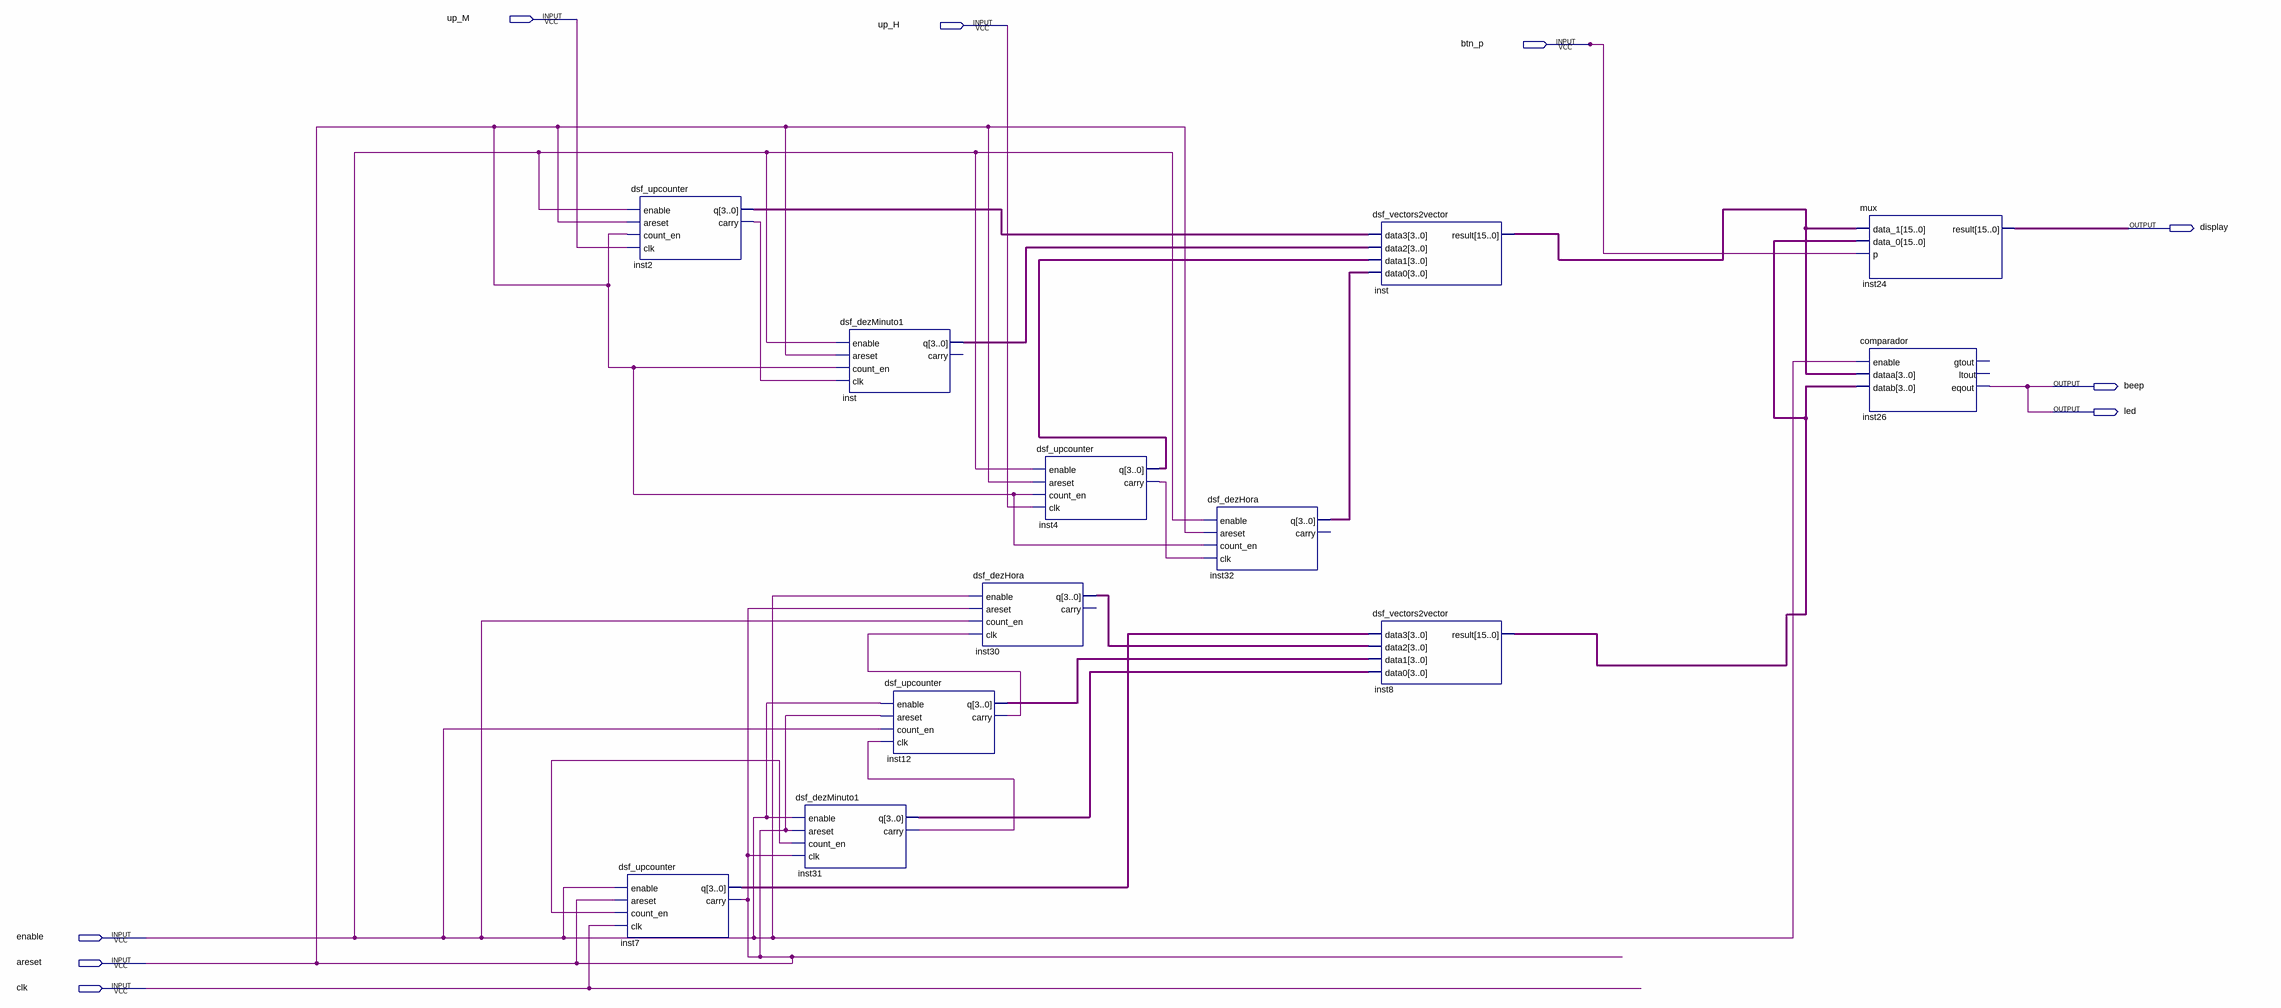
[diagram p0: schematic sheet]
// Quartus schematic Despertador.bdf as structural Verilog: 12 symbols, 9 pins
module Despertador (
  input  up_M,
  input  up_H,
  input  btn_p,
  input  enable,
  input  areset,
  input  clk,
  output display,
  output beep,
  output led
);

  wire inst2_carry, inst4_carry, inst12_carry, inst31_carry, undriven;
  wire [3:0] inst2_q, inst4_q, inst7_q, inst12_q, inst30_q, inst31_q, inst32_q, inst_q;
  wire [15:0] inst8_result, inst24_result, inst_result;

  dsf_upcounter inst7 (.enable(enable), .areset(areset), .count_en(undriven), .clk(clk), .q(inst7_q), .carry(areset));
  dsf_upcounter inst2 (
    .enable(enable), .areset(areset), .count_en(areset), .clk(up_M), .q(inst2_q), .carry(inst2_carry));
  dsf_dezMinuto1 inst31 (
    .enable(enable), .areset(areset), .count_en(undriven), .clk(areset), .q(inst31_q), .carry(inst31_carry));
  dsf_dezMinuto1 inst (
    .enable(enable), .areset(areset), .count_en(areset), .clk(inst2_carry), .q(inst_q));  // open: carry
  dsf_upcounter inst12 (
    .enable(enable), .areset(areset), .count_en(enable), .clk(inst31_carry), .q(inst12_q),
    .carry(inst12_carry));
  dsf_dezHora inst30 (
    .enable(enable), .areset(areset), .count_en(enable), .clk(inst12_carry), .q(inst30_q));  // open: carry
  dsf_upcounter inst4 (
    .enable(enable), .areset(areset), .count_en(areset), .clk(up_H), .q(inst4_q), .carry(inst4_carry));
  dsf_dezHora inst32 (
    .enable(enable), .areset(areset), .count_en(areset), .clk(inst4_carry), .q(inst32_q));  // open: carry
  dsf_vectors2vector inst_dup2 (
    .data3(inst2_q), .data2(inst_q), .data1(inst4_q), .data0(inst32_q), .result(inst_result));
  dsf_vectors2vector inst8 (
    .data3(inst7_q), .data2(inst30_q), .data1(inst12_q), .data0(inst31_q), .result(inst8_result));
  mux inst24 (.data_1(inst_result), .data_0(inst8_result), .p(btn_p), .result(inst24_result));
  comparador inst26 (.enable(enable), .dataa(inst_result), .datab(inst8_result), .eqout(beep));  // open: gtout, ltout

  assign led = beep;
endmodule
